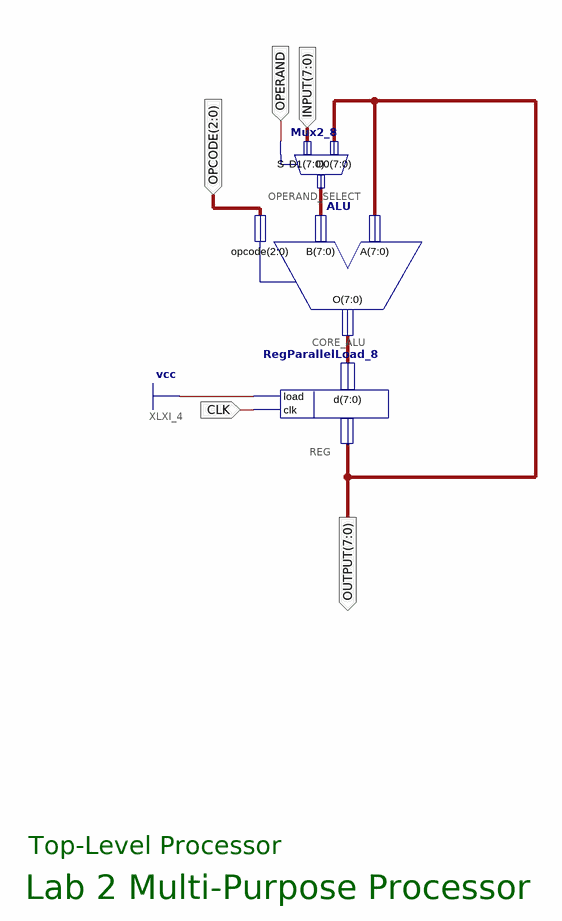
[diagram p0: schematic sheet 1]
// Xilinx ISE schematic MPP.sch (spartan3e) as structural Verilog: 3 symbols, 5 ports
module MPP (
  input  OPERAND,
  input  [2:0] OPCODE,
  input  [7:0] INPUT,
  input  CLK,
  output [7:0] OUTPUT
);

  wire [7:0] XLXN_8, XLXN_10;

  Mux2_8 OPERAND_SELECT (.O(XLXN_8), .D0(OUTPUT), .D1(INPUT), .S(OPERAND));
  RegParallelLoad_8 REG (.clk(CLK), .q(OUTPUT), .load(1'b1), .d(XLXN_10));
  ALU CORE_ALU (.A(OUTPUT), .B(XLXN_8), .O(XLXN_10), .opcode(OPCODE));

  // Notes on the sheet:
  //   Top-Level Processor
  //   Lab 2 Multi-Purpose Processor
endmodule
